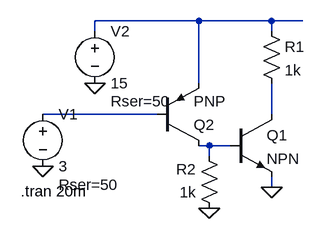
[diagram p0: schematic inverted_saturation.asc]
inverted_saturation.asc, the LTspice schematic file:
Version 4
SHEET 1 880 680
WIRE 240 32 80 32
WIRE 352 32 240 32
WIRE 400 32 352 32
WIRE 80 48 80 32
WIRE 352 48 352 32
WIRE 240 128 240 32
WIRE 176 176 0 176
WIRE 352 176 352 128
WIRE 256 224 240 224
WIRE 288 224 256 224
WIRE 256 240 256 224
WIRE 352 288 352 272
FLAG 80 128 0
FLAG 0 256 0
FLAG 352 288 0
FLAG 256 320 0
SYMBOL voltage 0 160 R0
WINDOW 123 0 0 Left 2
WINDOW 39 24 124 Left 2
SYMATTR InstName V1
SYMATTR Value 3
SYMATTR SpiceLine Rser=50
SYMBOL voltage 80 32 R0
WINDOW 123 0 0 Left 2
WINDOW 39 24 124 Left 2
SYMATTR InstName V2
SYMATTR Value 15
SYMATTR SpiceLine Rser=50
SYMBOL npn 288 176 R0
SYMATTR InstName Q1
SYMBOL pnp 176 224 M180
SYMATTR InstName Q2
SYMBOL res 336 32 R0
SYMATTR InstName R1
SYMATTR Value 1k
SYMBOL res 272 336 R180
WINDOW 0 36 76 Left 2
WINDOW 3 36 40 Left 2
SYMATTR InstName R2
SYMATTR Value 1k
TEXT -34 294 Left 2 !.tran 20m

The netlist it stands for:
* inverted_saturation.asc
V1 N002 0 3 Rser=50
V2 N001 0 15 Rser=50
Q1 N003 N004 0 0 NPN
Q2 N004 N002 N001 0 PNP
R1 N001 N003 1k
R2 0 N004 1k
.model NPN NPN
.model PNP PNP
.lib standard.bjt
.tran 20m
.backanno
.end